# Altium schematic sheet Sheet2.SchDoc
size Letter; Author: Camille Fortin; CompanyName: Cégep Limoilou; Organization: Cegep Limoilou; Address1: 1300, 8e Avenue; Address2: Québec, QC; Address3: Canada; Address4: G1J 5L5; Revision: A; SheetNumber: 2; SheetTotal: 3; Conception: C.F.; Titre: Panneau Projet Adam; Modification: C.F.
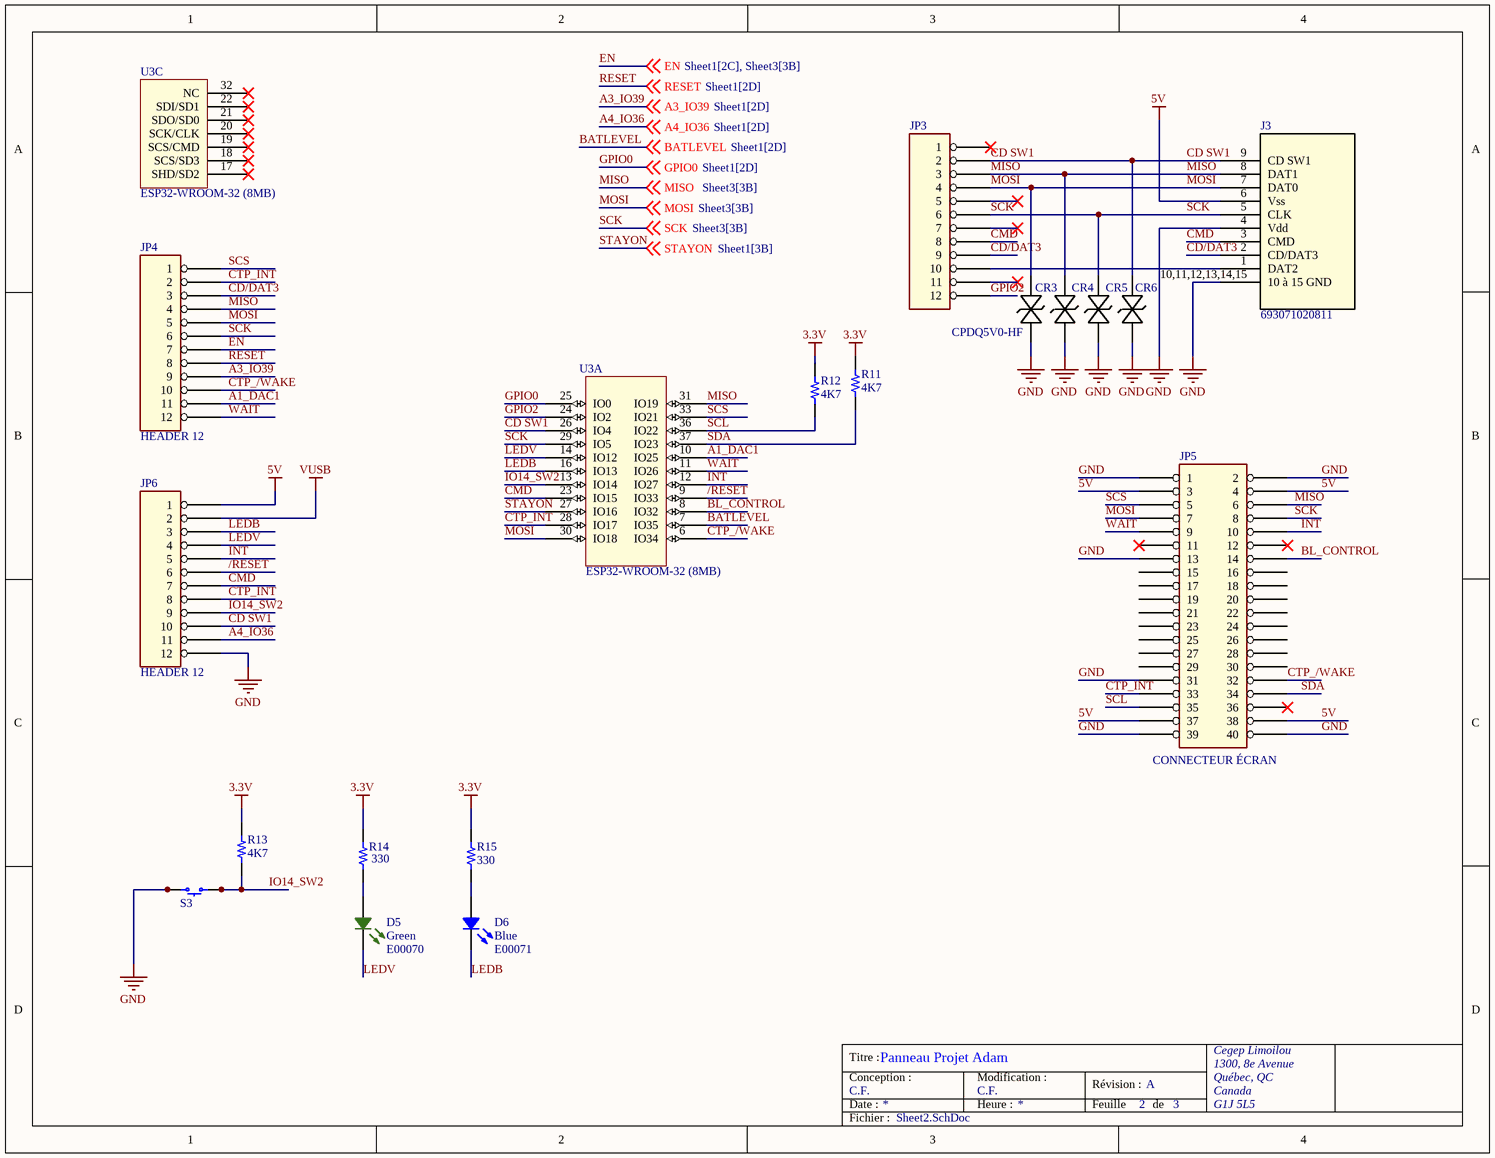
[diagram p0: Sheet2.SchDoc]

## Parts
CR3  CPDQ5V0-HF  [CPDQ-M]
CR4  CPDQ5V0-HF  [CPDQ-M]  (value not drawn)
CR5  CPDQ5V0-HF  [CPDQ-M]  (value not drawn)
CR6  CPDQ5V0-HF  [CPDQ-M]  (value not drawn)
D5  Green  ADAM Inventory Number 1: E00070  [Green LED 0603]
D6  Blue  ADAM Inventory Number 1: E00071  [Blue LED 0603]
J3  693071020811  [CONN9_020811_WRE]
JP3  HEADER 12  [CONN 12PIN FEMALE]  (value not drawn)
JP4  HEADER 12  [CONN 12PIN FEMALE]
JP5  CONNECTEUR ÉCRAN  [J\40P]
JP6  HEADER 12  [CONN 12PIN FEMALE]
R11  4K7  [RES 0603]
R12  4K7  [RES 0603]
R13  4K7  [RES 0603]
R14  330  [RES 0603]
R15  330  [RES 0603]
S3  KMR741NG ULC LFS  [Switch Lin SMD]  (value not drawn)
U3  ESP32-WROOM-32 (8MB)  [ESP32-WROOM-32D]  (parts A,C of 3)

## Nets
3.3V: R11.2 R12.2 R13.2 R14.2 R15.2
5V: J3.6(Vss) JP5.3 JP5.4 JP5.37 JP5.38 JP6.1
GND: CR3.1 CR4.1 CR5.1 CR6.1 J3.4(Vdd) J3.10,11,12,13,14,15(10_à_15_GND) JP5.1 JP5.2 JP5.13 JP5.31 JP5.39 JP5.40 JP6.12 S3.3 S3.4
VUSB: JP6.2
/RESET: JP6.6 U3.9(IO33)
A1_DAC1: JP4.11 U3.10(IO25)
A3_IO39: JP4.9 ; off-sheet A3_IO39
A4_IO36: JP6.11 ; off-sheet A4_IO36
BATLEVEL: U3.7(IO35) ; off-sheet BATLEVEL
BL_CONTROL: JP5.14 U3.8(IO32)
CD SW1: CR6.2 J3.9(CD_SW1) JP3.2 JP6.10 U3.26(IO4)
CD/DAT3: J3.2(CD/DAT3) JP3.9 JP4.3
CMD: J3.3(CMD) JP3.8 JP6.7 U3.23(IO15)
CTP_/WAKE: JP4.10 JP5.32 U3.6(IO34)
CTP_INT: JP4.2 JP5.33 JP6.8 U3.28(IO17)
EN: JP4.7 ; off-sheet EN
GPIO0: U3.25(IO0) ; off-sheet GPIO0
GPIO2: JP3.12 U3.24(IO2)
INT: JP5.10 JP6.5 U3.12(IO27)
IO14_SW2: JP6.9 R13.1 S3.1 S3.2 U3.13(IO14)
LEDB: D6.2 JP6.3 U3.16(IO13)
LEDV: D5.2 JP6.4 U3.14(IO12)
MISO: CR4.2 J3.8(DAT1) JP3.3 JP4.4 JP5.6 U3.31(IO19) ; off-sheet MISO
MOSI: CR3.2 J3.7(DAT0) JP3.4 JP4.5 JP5.7 U3.30(IO18) ; off-sheet MOSI
RESET: JP4.8 ; off-sheet RESET
SCK: CR5.2 J3.5(CLK) JP3.6 JP4.6 JP5.8 U3.29(IO5) ; off-sheet SCK
SCL: JP5.35 R12.1 U3.36(IO22)
SCS: JP4.1 JP5.5 U3.33(IO21)
SDA: JP5.34 R11.1 U3.37(IO23)
STAYON: U3.27(IO16) ; off-sheet STAYON
WAIT: JP4.12 JP5.9 U3.11(IO26)
NetD5_1: D5.1 R14.1
NetD6_1: D6.1 R15.1
NetJ3_1: J3.1(DAT2) JP3.10

Not connected (* = marked no-connect by the designer): JP3 1* 5* 7* 11*; JP5 11* 12* 15 16 17 18 19 20 21 22 23 24 25 26 27 28 29 30 36*; U3 17(SHD/SD2)* 18(SCS/SD3)* 19(SCS/CMD)* 20(SCK/CLK)* 21(SDO/SD0)* 22(SDI/SD1)* 32(NC)*

## Notes on the sheet
- Titre :
- Conception :
- Date :
- Modification :
- Heure :
- Révision :
- Feuille
- de
- Fichier :

## Library data of the parts
CR3-CR6 = CPDQ5V0-HF: Diode TVS bidirectionnel; Mfr_Name: Comchip
D5 = 0603 GREEN LED: LED GREEN 0603 SMD; Manufacturer Part Number 1: 5973316507F; Manufacturer: Dialight; Configuration: Standard; Current - Test: 20mA; Lens Color: 1.24mm; Lens Style: Round with Domed Top; Millicandela Rating: 34mcd; Voltage - Forward (Vf) (Typ): 2V; Wavelength - Dominant: 560nm; Color: Green; ComponentLink1Description: Datasheet; ComponentLink1URL: http://www.dialightsignalsandcomponents.com/Assets/Drawings/2D_Drawings_DrawingDetailedSpec/NewDrawings/C18371C.pdf; ComponentLink2Description: DigiKey Link; ComponentLink2URL: https://www.digikey.com/en/products/detail/dialight/5973316507F/9385428; Device Package: 0603 (1608 Metric); Height (Max): 1.24mm; LastUpdated: 2023-03-27 19:52:49; Lifecycle Status: Active; Minimum Order: 1; Mounting Type: Surface Mount; Package / Case: 0603 (1608 Metric); Packaging: TapeAndReel; PartId: 587; Part Status: Active; Price: 0.13; Series: 597; Size / Dimension: 1.60mm L x 0.80mm W; Supplier 1: DigiKey; Supplier Part Number 1: 350-4373-1-ND; Supplier Device Package: 0603; Value: Green
D6 = 0603 BLUE LED: Blue 470nm LED Indication - Discrete 3.3V 0603 (1608 Metric); Manufacturer Part Number 1: APT1608LVBC/D; Supplier 1: Digi-Key; Supplier Part Number 1: 754-1933-1-ND
J3 = 693071020811: No Description Available; Mfr_Name: Wurth Electronics; Copyright: Copyright (C) 2023 Ultra Librarian. All rights reserved.; RefDes: RefDes; Type: DEV; Manufacturer Part Number 1: 693071020811
JP5 = HEADER 20X2
R11-R13 = RT0603FRE074K7L: RES SMD 4.7K OHM 1% 1/10W 0603; Manufacturer: Yageo; Power (Watts): 0.1W, 1/10W; Resistance: 4.7 kOhms; Temperature Coefficient: ±50ppm/°C; Part Number: RT0603FRE074K7L; Value: 4K7; ComponentLink1Description: Datasheet; ComponentLink1URL: https://www.yageo.com/upload/media/product/productsearch/datasheet/rchip/PYu-RT_1-to-0.01_RoHS_L_11.pdf; ComponentLink2Description: DigiKey Link; ComponentLink2URL: https://www.digikey.com/en/products/detail/yageo/RT0603FRE074K7L/1075404; Composition: Thin Film; Device Package: 0603 (1608 Metric); Height - Seated (Max): 0.022" (0.55mm); LastUpdated: 2023-03-28 19:30:03; Lifecycle Status: Active; Minimum Order: 1; Number of Terminations: 2; Operating Temperature: -55°C ~ 155°C; Package / Case: 0603 (1608 Metric); Packaging: TapeAndReel; PartId: 5678; Part Status: Active; Price: 0.01; Series: RT; Size / Dimension: 0.063" L x 0.031" W (1.60mm x 0.80mm); Supplier 1: DigiKey; Supplier Part Number 1: YAG1238CT-ND; Supplier Device Package: 0603; Tolerance: ±1%; Manufacturer Part Number 1: RT0603FRE074K7L
R14 R15 = CPF0603B1K0E: RES SMD 1K OHM 0.1% 1/16W 0603; Manufacturer: TE Connectivity Passive Product; Power (Watts): 0.063W, 1/16W; Resistance: 1 kOhms; Temperature Coefficient: ±25ppm/°C; Part Number: CPF0603B1K0E; Value: 330; ComponentLink1Description: Datasheet; ComponentLink1URL: https://www.te.com/commerce/DocumentDelivery/DDEController?Action=srchrtrv&DocNm=1773200&DocType=DS&DocLang=English; ComponentLink2Description: DigiKey Link; ComponentLink2URL: https://www.digikey.com/en/products/detail/te-connectivity-passive-product/CPF0603B1K0E/2390473; Composition: Thin Film; Device Package: 0603 (1608 Metric); Height - Seated (Max): 0.022" (0.55mm); LastUpdated: 2023-03-28 19:30:06; Lifecycle Status: Active; Minimum Order: 1; Number of Terminations: 2; Operating Temperature: -55°C ~ 155°C; Package / Case: 0603 (1608 Metric); Packaging: TapeAndReel; PartId: 4877; Part Status: Active; Price: 0.09; Series: CPF, Neohm; Size / Dimension: 0.061" L x 0.031" W (1.55mm x 0.80mm); Supplier 1: DigiKey; Supplier Part Number 1: A119887CT-ND; Supplier Device Package: 0603; Tolerance: ±0.1%; Manufacturer Part Number 1: CPF0603B1K0E
S3 = KMR741NG ULC LFS: SWITCH TACTILE SPST-NO 50MA 32V; Manufacturer: C&K; Actuator Height off PCB, Vertical: 2.50mm; Actuator Orientation: Top Actuated; Actuator Type: Standard; Contact Rating @ Voltage: 0.05A @ 32VDC; Illumination: Non-Illuminated; Ingress Protection: IP67 - Dust Tight, Waterproof; Operating Force: 400gf; Outline: 4.20mm x 2.80mm; Switch Function: Off-Mom; Part Number: KMR741NG ULC LFS; Circuit: SPST-NO; ComponentLink1Description: Datasheet; ComponentLink1URL: https://dznh3ojzb2azq.cloudfront.net/products/Tactile/KMR7/documents/datasheet.pdf; ComponentLink2Description: DigiKey Link; ComponentLink2URL: http://digikey.com/product-detail/en/c-k/KMR741NG-ULC-LFS/CKN10688CT-ND/6035360; LastUpdated: 2020-04-09 10:01:05; Lifecycle Status: Active; Minimum Order: 1; Mounting Type: Surface Mount; Operating Temperature: -40°C ~ 85°C; Packaging: TapeAndReel; Part Status: Active; Price: 0.16; Series: KMR7; Supplier 1: DigiKey; Supplier Part Number 1: CKN10688CT-ND; Termination Style: Gull Wing; Manufacturer Part Number 1: KMR741NG ULC LFS
U3 = ESP32-WROOM-32 (8MB): No Description Available; Mfr_Name: Espressif Systems; Copyright: Copyright (C) 2023 Ultra Librarian. All rights reserved.; RefDes: RefDes; Type: DEV; Manufacturer Part Number 1: ESP32-WROOM-32 (8MB)